# Altium project ESP_Grow_Main_Rev_B.PrjPCB (part 1 of 2)
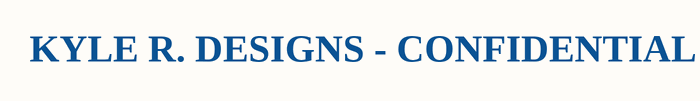
[diagram p0: ESP_Grow_Main_Rev_B_0_Title.SchDoc]
6 sheets, 125 parts. Net scope: global (net labels, ports and power ports of the same name join across sheets).
Board file: ESP_Grow_Main_Rev_B.PcbDoc
Sheets:
  ESP_Grow_Main_Rev_B_0_Title.SchDoc
  ESP_Grow_Main_Rev_B_1_CPU.SchDoc
  ESP_Grow_Main_Rev_B_2_Con.SchDoc
  ESP_Grow_Main_Rev_B_3.SchDoc
  ESP_Grow_Main_Rev_B_4_3V_5V.SchDoc
  ESP_Grow_Main_Rev_B_5_ChangeLog.SchDoc

## Sheet ESP_Grow_Main_Rev_B_0_Title.SchDoc
size A

### Notes on the sheet
- KYLE R. DESIGNS - CONFIDENTIAL

## Sheet ESP_Grow_Main_Rev_B_1_CPU.SchDoc
size A
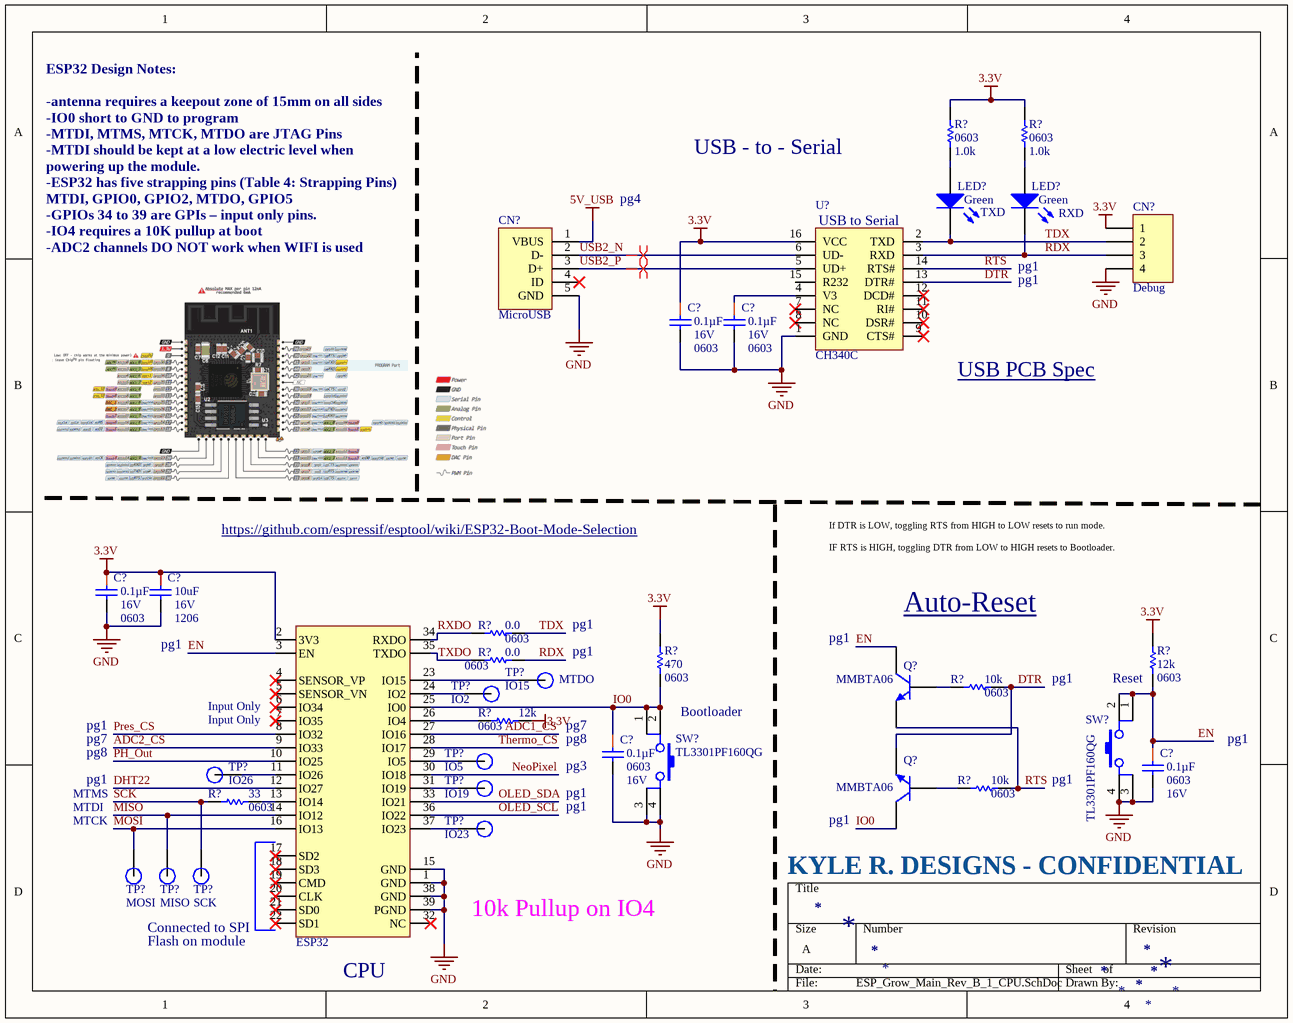
[diagram p1: ESP_Grow_Main_Rev_B_1_CPU.SchDoc]

### Parts
(Parts that share a designator on the sheet are numbered #1, #2 ... from top to bottom, then left to right.)
C?#1  Capacitance: 0.1µF  Package / Case: 0603  Voltage - Rated: 16V  [CAPC0603(1608)_L]  (hidden comment: 0.1uF)
C?#2  Capacitance: 0.1µF  Package / Case: 0603  Voltage - Rated: 16V  [CAPC0603(1608)_L]  (hidden comment: 0.1uF)
C?#3  Capacitance: 0.1µF  Package / Case: 0603  Voltage - Rated: 16V  [CAPC0603(1608)_L]  (hidden comment: 0.1uF)
C?#4  10uF  Voltage - Rated: 16V  Package: 1206  [CAPC1206(3216)_M]
C?#5  Capacitance: 0.1µF  Package / Case: 0603  Voltage - Rated: 16V  [CAPC0603(1608)_L]  (hidden comment: 0.1uF)
C?#6  Capacitance: 0.1µF  Package / Case: 0603  Voltage - Rated: 16V  [CAPC0603(1608)_L]  (hidden comment: 0.1uF)
CN?#1  Debug  [HDR1X4]
CN?#2  MicroUSB  [10118194-0001LF]
LED?#1  TXD  Color: Green  [SM-LED-0603]
LED?#2  RXD  Color: Green  [SM-LED-0603]
Q?#1  MMBTA06  [SOT23]
Q?#2  MMBTA06  [SOT23]
R?#1  Package / Case: 0603  [RESC0603(1608)_N]  (hidden comment: 1.0K)
R?#2  Package / Case: 0603  [RESC0603(1608)_N]  (hidden comment: 1.0K)
R?#3  Resistance (Ohms): 0.0  Package / Case: 0603  [RESC0603(1608)_N]  (hidden comment: 0)
R?#4  Resistance (Ohms): 0.0  Package / Case: 0603  [RESC0603(1608)_N]  (hidden comment: 0)
R?#5  Package / Case: 0603  [RESC0603(1608)_N]  (hidden comment: 470)
R?#6  Package / Case: 0603  [RESC0603(1608)_N]  (hidden comment: 12K)
R?#7  Resistance (Ohms): 10k  Package / Case: 0603  [RESC0603(1608)_L]  (hidden comment: 10K 1%)
R?#8  Package / Case: 0603  [RESC0603(1608)_N]  (hidden comment: 12K)
R?#9  Resistance (Ohms): 10k  Package / Case: 0603  [RESC0603(1608)_L]  (hidden comment: 10K 1%)
R?#10  Package / Case: 0603  [RESC0603(1608)_L]  (hidden comment: 33)
SW?#1  TL3301PF160QG  [TL3301PF160QG]
SW?#2  TL3301PF160QG  [TL3301PF160QG]
TP?#1  IO15  [TestPoint-Silk]  (no BOM)
TP?#2  IO2  [TestPoint-Silk]  (no BOM)
TP?#3  IO5  [TestPoint-Silk]  (no BOM)
TP?#4  IO26  [TestPoint-Silk]  (no BOM)
TP?#5  IO19  [TestPoint-Silk]  (no BOM)
TP?#6  IO23  [TestPoint-Silk]  (no BOM)
TP?#7  MOSI  [TestPoint-Silk]  (no BOM)
TP?#8  MISO  [TestPoint-Silk]  (no BOM)
TP?#9  SCK  [TestPoint-Silk]  (no BOM)
U?#1  CH340C  [SOP-16]
U?#2  ESP32  [ESP32]

### Nets
3.3V: C?#1.1 C?#3.1 C?#4.1 CN?#1.1 R?#1.2 R?#2.2 R?#5.2 R?#6.2 R?#8.1 U?#1.16(VCC) U?#2.2(3V3)
5V_USB: CN?#2.1(VBUS)
GND: C?#1.2 C?#2.2 C?#3.2 C?#4.2 C?#5.2 C?#6.2 CN?#1.4 CN?#2.5(GND) SW?#1.3 SW?#1.4 SW?#2.3 SW?#2.4 U?#1.1(GND) U?#2.1(GND) U?#2.15(GND) U?#2.38(GND) U?#2.39(PGND)
ADC1_CS: U?#2.27(IO16)
ADC2_CS: U?#2.9(IO33)
DHT22: U?#2.12(IO27)
DTR: Q?#2.2(E) R?#7.1 U?#1.13(DTR#)
EN: C?#6.1 Q?#1.3(C) R?#6.1 SW?#1.1 SW?#1.2 U?#2.3(EN)
IO0: C?#5.1 Q?#2.3(C) R?#5.1 SW?#2.1 SW?#2.2 U?#2.25(IO0)
MISO: TP?#8.1 U?#2.14(IO12)
MOSI: TP?#7.1 U?#2.16(IO13)
NeoPixel: U?#2.30(IO18)
OLED_SCL: U?#2.36(IO22)
OLED_SDA: U?#2.33(IO21)
PH_Out: U?#2.10(IO25)
Pres_CS: U?#2.8(IO32)
RDX: CN?#1.3 LED?#2.2 R?#4.1 U?#1.3(RXD)
RTS: Q?#1.2(E) R?#9.1 U?#1.14(RTS#)
RXDO: R?#3.2 U?#2.34(RXDO)
SCK: R?#10.2 TP?#9.1
TDX: CN?#1.2 LED?#1.2 R?#3.1 U?#1.2(TXD)
Thermo_CS: U?#2.28(IO17)
TXDO: R?#4.2 U?#2.35(TXDO)
USB2_N: CN?#2.2(D-) U?#1.6(UD-)
USB2_P: CN?#2.3(D+) U?#1.5(UD+)
NetC?#2_1: C?#2.1 U?#1.4(V3)
NetLED?#1_1: LED?#1.1 R?#1.1
NetLED?#2_1: LED?#2.1 R?#2.1
NetQ?#1_1: Q?#1.1(B) R?#7.2
NetQ?#2_1: Q?#2.1(B) R?#9.2
NetR?#8_2: R?#8.2 U?#2.26(IO4)
NetR?#10_1: R?#10.1 U?#2.13(IO14)
NetTP?#1_1: TP?#1.1 U?#2.23(IO15)
NetTP?#2_1: TP?#2.1 U?#2.24(IO2)
NetTP?#3_1: TP?#3.1 U?#2.29(IO5)
NetTP?#4_1: TP?#4.1 U?#2.11(IO26)
NetTP?#5_1: TP?#5.1 U?#2.31(IO19)
NetTP?#6_1: TP?#6.1 U?#2.37(IO23)

Not connected (* = marked no-connect by the designer): CN?#2 4(ID)*; U?#1 7(NC)* 8(NC)* 9(CTS#)* 10(DSR#)* 11(RI#)* 12(DCD#)* 15(R232); U?#2 4(SENSOR_VP)* 5(SENSOR_VN)* 6(IO34)* 7(IO35)* 17(SD2)* 18(SD3)* 19(CMD)* 20(CLK)* 21(SD0)* 22(SD1)* 32(NC)*

### Layout directives
differential pair: USB2_N, USB2_P

### Notes on the sheet
- USB - to - Serial
- pg4
- pg1
- (near LED?#2) pg1
- USB PCB Spec <https://www.ftdichip.com/Support/Documents/AppNotes/AN_146_USB_Hardware_Design_Guidelines_for_FTDI_ICs.pdf>
- ESP32 Design Notes:
  -antenna requires a keepout zone of 15mm on all sides
  -IO0 short to GND to program
  -MTDI, MTMS, MTCK, MTDO are JTAG Pins
  -MTDI should be kept at a low electric level when powering up the module.
  -ESP32 has five strapping pins (Table 4: Strapping Pins) MTDI, GPIO0, GPIO2, MTDO, GPIO5
  -GPIOs 34 to 39 are GPIs – input only pins.
  -IO4 requires a 10K pullup at boot
  -ADC2 channels DO NOT work when WIFI is used
- https://github.com/espressif/esptool/wiki/ESP32-Boot-Mode-Selection
- If DTR is LOW, toggling RTS from HIGH to LOW resets to run mode.
  IF RTS is HIGH, toggling DTR from LOW to HIGH resets to Bootloader.
- Auto-Reset <https://cdn.sparkfun.com/assets/learn_tutorials/5/0/7/esp32-thing-schematic.pdf>
- (near C?#4) pg1
- (near TP?#1) MTDO
- (near TP?#1) pg1
- (near R?#6) Reset
- pg7
- pg8
- (near U?#2) Input Only
- (near C?#5) pg3
- (near C?#5) pg8
- Bootloader
- MTMS
- MTDI
- MTCK
- (near C?#5) pg1
- (near Q?#2) pg1
- KYLE R. DESIGNS - CONFIDENTIAL
- Flash on module
- Connected to SPI
- 10k Pullup on IO4
- (near U?#2) CPU
- (in symbol CH340C) USB to Serial

### Library data of the parts
C?#1-C?#3 C?#5 C?#6 = CAP CER 0.1UF 16V 10% X7R 0603: 0.1uF 0603 16V; Manufacturer: Kemet; Manufacturer Part Number: C0603C104K4RACTU; Tolerance: ±10%; Temperature Coefficient: X7R; Supplier 1: Digi-Key; RoHS: RoHS Compliant; Category: Capacitors; Stock 1: 2360000; Pricing 1: 4000=0.00414, 8000=0.00378, 12000=0.0036, 28000=0.00342, 100000=0.00248 (USD); Packaging: Tape & Reel (TR); Mounting Type: Surface Mount, MLCC; Operating Temperature: -55°C ~ 125°C; Applications: General Purpose; Ratings: -; Size / Dimension: 0.063" L x 0.031" W (1.60mm x 0.80mm); Height - Seated (Max): -; Thickness (Max): 0.034" (0.87mm); Lead Spacing: -; Features: -; Lead Style: -; ComponentLink1URL: http://www.kemet.com/datasheets&C0603C104K4RACTU; ComponentLink1Description: http://www.kemet.com/datasheets&C0603C104K4RACTU; Supplier Part Number 1: 399-1096-2-ND
C?#4 = CAP CER 10UF 16V 1206: Temperature Coefficient: X7R; LCSC: C126600; Capacitance: 10uF; Supplier 1: Digi-Key; Supplier Part Number 1: 490-4793-1-ND
CN?#1 = Header 4: Header, 4-Pin; Manufacturer: Sullins Connector Solutions; Manufacturer Part Number: PRPC004SAAN-RC; Connector Type: Header, Unshrouded, Breakaway; Number of Positions: 4; Number of Positions Loaded: All; Pitch: 0.100" (2.54mm); Supplier 1: Digi-Key; RoHS: RoHS Compliant; Category: Connectors, Interconnects; Stock 1: 0; Pricing 1: 1=0.2, 10=0.175, 100=0.1443, 500=0.1141, 1000=0.09794, 5000=0.08935, 10000=0.08591 (USD); Packaging: Bulk; Contact Type: Male Pin; Number of Rows: 1; Row Spacing: -; Contact Mating Length: 0.230" (5.84mm); Mounting Type: Through Hole; Termination: Solder; Fastening Type: -; Features: -; Contact Finish: Gold; Contact Finish Thickness: Flash; Color: Black; ComponentLink1URL: http://media.digikey.com/PDF/Data%20Sheets/Sullins%20PDFs/xRxCzzzSxxN-RC_ST_11635-B.pdf; ComponentLink1Description: http://media.digikey.com/PDF/Data%20Sheets/Sullins%20PDFs/xRxCzzzSxxN-RC_ST_11635-B.pdf; Supplier Part Number 1: S1011EC-04-ND
CN?#2 = 10118194-0001LF: Amphenol FCI CONN USB MICRO B RECPT SMT R/A; Connector Type: USB - micro B; Number of Contacts: 5; Gender: Receptacle; Specifications: USB 2.0; Number of Ports: 1; Current Rating: 1.8A per Contact; Voltage - Rated: 100VAC; Mating Cycles: 10000; Shielding: Shielded; Material Flammability Rating: UL94 V-0; ClassName: *; Supplier 1: Digi-Key; Manufacturer: Amphenol FCI; Manufacturer Part Number: 10118194-0001LF; RoHS: RoHS Compliant; Category: Connectors, Interconnects; Stock 1: 220681; Pricing 1: 1=0.46, 10=0.437, 25=0.3744, 50=0.318, 100=0.3056, 250=0.27444, 500=0.26196 (USD); Packaging: Cut Tape (CT); Part Status: Active; Mounting Type: Surface Mount, Right Angle; Through Hole; Mounting Feature: Horizontal; Termination: Solder; Features: Solder Retention; Ingress Protection: -; Operating Temperature: -30°C ~ 80°C; Contact Finish: Gold; Shell/Shielding Material: Steel, Stainless; Insulation Color: Black; ComponentLink1URL: http://portal.fciconnect.com/Comergent//fci/drawing/10118194.pdf; ComponentLink1Description: http://portal.fciconnect.com/Comergent//fci/drawing/10118194.pdf; Supplier Part Number 1: 609-4618-1-ND
LED?#1 LED?#2 = LTST-C191KGKT: LED GREEN CLEAR THIN 0603 SMD; Manufacturer: Lite-On Inc; Wavelength - Dominant: 571nm; Wavelength - Peak: 574nm; Millicandela Rating: 35mcd; Voltage - Forward (Vf) (Typ): 2V; Current - Test: 20mA; Viewing Angle: 130°; Lens Style/Size: Rectangle with Flat Top, 1.1mm x 0.8mm; Supplier 1: Digi-Key; Manufacturer Part Number: LTST-C191KGKT; RoHS: RoHS Compliant; Category: Optoelectronics; Stock 1: 84829; Pricing 1: 1=0.3, 10=0.238, 100=0.1296, 250=0.0864, 500=0.07344, 1000=0.05616, 2500=0.05076 (USD); Packaging: Cut Tape (CT); Lens Type: Clear; Package / Case: 0603 (1608 Metric); Size / Dimension: 1.60mm L x 0.80mm W; Height: 0.55mm; Mounting Type: Surface Mount; Luminous Flux @ Current - Test: -; ComponentLink1URL: http://optoelectronics.liteon.com/upload/download/DS22-2000-228/S_110_LTST-C191KGKT.pdf; ComponentLink1Description: http://optoelectronics.liteon.com/upload/download/DS22-2000-228/S_110_LTST-C191KGKT.pdf; Supplier Part Number 1: 160-1446-1-ND; ClassName: *
Q?#1 Q?#2 = MMBTA06: TRANS NPN 80V 0.5A SOT-23; Manufacturer: ON Semiconductor; Manufacturer Part Number: MMBTA06LT3G; Vce Saturation (Max) @ Ib, Ic: 250mV @ 10mA, 100mA; Current - Collector Cutoff (Max): 100nA; DC Current Gain (hFE) (Min) @ Ic, Vce: 100 @ 100mA, 1V; Frequency - Transition: 100MHz; Supplier 1: Digi-Key; RoHS: RoHS Compliant; Category: Discrete Semiconductor Products; Stock 1: 16604; Pricing 1: 1=0.21, 10=0.196, 100=0.1067, 500=0.06566, 1000=0.04476 (USD); Packaging: Cut Tape (CT); Part Status: Active; Transistor Type: NPN; Operating Temperature: -55°C ~ 150°C (TJ); Mounting Type: Surface Mount; Package / Case: TO-236-3, SC-59, SOT-23-3; Supplier Device Package: SOT-23-3 (TO-236); Base Part Number: MMBTA06; ComponentLink1URL: http://www.onsemi.com/pub/Collateral/MMBTA05LT1-D.PDF; ComponentLink1Description: http://www.onsemi.com/pub/Collateral/MMBTA05LT1-D.PDF; Supplier Part Number 1: MMBTA06LT3GOSCT-ND
R?#1 R?#2 = RES 1K OHM 1% 1/10W 0603: 1.0K 0603; Manufacturer: Stackpole Electronics Inc.; Manufacturer Part Number: RMCF0603FT1K00; Tolerance: ±1%; Power (Watts): 0.1W, 1/10W; Temperature Coefficient: ±100ppm/°C; Supplier 1: Digi-Key; RoHS: RoHS Compliant; Category: Resistors; Stock 1: 411308; Pricing 1: 1=0.1, 10=0.02, 100=0.0081, 1000=0.00364, 2500=0.00316 (USD); Packaging: Cut Tape (CT); Part Status: Active; Composition: Thick Film; Features: Automotive AEC-Q200; Operating Temperature: -55°C ~ 155°C; Size / Dimension: 0.061" L x 0.031" W (1.55mm x 0.80mm); Height - Seated (Max): 0.022" (0.55mm); Failure Rate: -; ComponentLink1URL: https://www.seielect.com/Catalog/SEI-RMCF_RMCP.pdf; ComponentLink1Description: https://www.seielect.com/Catalog/SEI-RMCF_RMCP.pdf; Supplier Part Number 1: RMCF0603FT1K00CT-ND; Supplier Device Package: 0603; Resistance (Ohms): 1.0k
R?#3 R?#4 = RES 0.0 OHM 1/10W JUMP 0603 SMD: 0 0603; Manufacturer: Panasonic Electronic Components; Manufacturer Part Number: ERJ-3GEY0R00V; Tolerance: Jumper; Power (Watts): 0.1W, 1/10W; Supplier 1: Digi-Key; RoHS: RoHS Compliant; Category: Resistors; Stock 1: 4812214; Pricing 1: 1=0.1, 50=0.0126, 100=0.0096, 250=0.00716, 500=0.00528, 1000=0.00352, 2500=0.00297 (USD); Packaging: Cut Tape (CT); Composition: Thick Film; Features: -; Temperature Coefficient: -; Supplier Device Package: 0603; Size / Dimension: 0.063" L x 0.031" W (1.60mm x 0.80mm); Height: 0.022" (0.55mm); Number of Terminations: 2; ComponentLink1URL: http://industrial.panasonic.com/www-cgi/jvcr13pz.cgi?E+PZ+3+AOA0001+ERJ3GEY0R00V+7+WW; ComponentLink1Description: http://industrial.panasonic.com/www-cgi/jvcr13pz.cgi?E+PZ+3+AOA0001+ERJ3GEY0R00V+7+WW; Supplier Part Number 1: P0.0GCT-ND
R?#5 = RES 470 OHM 1/10W 1% 0603 SMD: 470 0603; Manufacturer: Yageo; Manufacturer Part Number: RC0603FR-07470RL; Tolerance: ±1%; Power (Watts): 0.1W, 1/10W; Temperature Coefficient: ±100ppm/°C; Supplier 1: Digi-Key; RoHS: RoHS Compliant; Category: Resistors; Stock 1: 184849; Pricing 1: 1=0.1, 10=0.015, 25=0.0108, 100=0.006, 250=0.00456, 500=0.00364, 1000=0.00268, 2500=0.00233 (USD); Packaging: Cut Tape (CT); Resistance (Ohms): 470; Composition: Thick Film; Features: -; Supplier Device Package: 0603; Size / Dimension: 0.063" L x 0.031" W (1.60mm x 0.80mm); Height: 0.022" (0.55mm); Number of Terminations: 2; ComponentLink1URL: http://www.yageo.com/documents/recent/PYu-RC0603_51_RoHS_L_4.pdf; ComponentLink1Description: http://www.yageo.com/documents/recent/PYu-RC0603_51_RoHS_L_4.pdf; Supplier Part Number 1: 311-470HRCT-ND
R?#6 R?#8 = RES 12K OHM 1/10W 1% 0603 SMD: 12K 1% 0603; Manufacturer: Rohm Semiconductor; Manufacturer Part Number: MCR03ERTF1202; Power (Watts): 0.1W, 1/10W; Temperature Coefficient: ±100ppm/°C; Supplier 1: Digi-Key; RoHS: RoHS Compliant; Category: Resistors; Stock 1: 128338; Pricing 1: 1=0.1, 10=0.011, 25=0.0084, 100=0.0047, 250=0.00356, 500=0.00286, 1000=0.0021 (USD); Packaging: Cut Tape (CT); Tolerance: ±1%; Composition: Thick Film; Features: -; Operating Temperature: -55°C ~ 155°C; Supplier Device Package: 0603 (1608 Metric); Size / Dimension: 0.063" L x 0.031" W (1.60mm x 0.80mm); Height: 0.022" (0.55mm); Number of Terminations: 2; ComponentLink1URL: http://rohmfs.rohm.com/en/products/databook/datasheet/passive/resistor/chip_resistor/mcr_g.pdf; ComponentLink1Description: http://rohmfs.rohm.com/en/products/databook/datasheet/passive/resistor/chip_resistor/mcr_g.pdf; Supplier Part Number 1: RHM12.0KCLCT-ND; Resistance (Ohms): 12k
R?#7 R?#9 = RES 10K OHM 1/10W 1% 0603 SMD: 10K 0603; Manufacturer: Panasonic Electronic Components; Manufacturer Part Number: ERJ-3EKF1002V; Power (Watts): 0.1W, 1/10W; Temperature Coefficient: ±100ppm/°C; Category: Resistors; Supplier 1: Digi-Key; RoHS: RoHS Compliant; Stock 1: 5046430; Pricing 1: 1=0.1, 50=0.015, 100=0.0114, 250=0.00844, 500=0.00624, 1000=0.00416, 2500=0.00351 (USD); Packaging: Cut Tape (CT); Tolerance: ±1%; Composition: Thick Film; Features: -; Supplier Device Package: 0603; Size / Dimension: 0.063" L x 0.031" W (1.60mm x 0.80mm); Height: 0.022" (0.55mm); Number of Terminations: 2; ComponentLink1URL: http://industrial.panasonic.com/www-cgi/jvcr13pz.cgi?E+PZ+3+AOA0002+ERJ3EKF1002V+7+WW; ComponentLink1Description: http://industrial.panasonic.com/www-cgi/jvcr13pz.cgi?E+PZ+3+AOA0002+ERJ3EKF1002V+7+WW; Supplier Part Number 1: P10.0KHCT-ND
R?#10 = RES 33 OHM 1/10W 5% 0603 SMD: 33 0603; Manufacturer: Panasonic Electronic Components; Manufacturer Part Number: ERJ-3GEYJ330V; Tolerance: ±5%; Power (Watts): 0.1W, 1/10W; Temperature Coefficient: ±200ppm/°C; Supplier 1: Digi-Key; RoHS: RoHS Compliant; Category: Resistors; Stock 1: 499360; Pricing 1: 1=0.1, 50=0.0126, 100=0.0096, 250=0.00716, 500=0.00528, 1000=0.00352, 2500=0.00297 (USD); Packaging: Cut Tape (CT); Resistance (Ohms): 33; Composition: Thick Film; Features: -; Supplier Device Package: 0603; Size / Dimension: 0.063" L x 0.031" W (1.60mm x 0.80mm); Height: 0.022" (0.55mm); Number of Terminations: 2; ComponentLink1URL: http://industrial.panasonic.com/www-cgi/jvcr13pz.cgi?E+PZ+3+AOA0001+ERJ3GEYJ330V+7+WW; ComponentLink1Description: http://industrial.panasonic.com/www-cgi/jvcr13pz.cgi?E+PZ+3+AOA0001+ERJ3GEYJ330V+7+WW; Supplier Part Number 1: P33GCT-ND
SW?#1 SW?#2 = TL3301PF160QG: SWITCH TACTILE SPST-NO 0.05A 12V; Manufacturer: E-Switch; Switch Function: Off-Mom; Contact Rating @ Voltage: 0.05A @ 12VDC; Actuator Type: Standard; Actuator Height off PCB, Vertical: 8.50mm; Actuator Orientation: Top Actuated; Outline: 6.00mm x 6.00mm; Illumination: Non-Illuminated; Operating Force: 160gf; Actuator Material: Polyamide (PA), Nylon; Switch Travel: 0.25mm; Mechanical Life: 100,000 Cycles; ClassName: *; Supplier 1: Digi-Key; Manufacturer Part Number: TL3301PF160QG; RoHS: RoHS Compliant; Category: Switches; Stock 1: 25527; Pricing 1: 1=0.38, 10=0.37, 25=0.3564, 50=0.3432, 100=0.33, 250=0.3036 (USD); Packaging: Cut Tape (CT); Part Status: Active; Circuit: SPST-NO; Mounting Type: Surface Mount; Actuator Length, Right Angle: -; Termination Style: Gull Wing; Illumination Type, Color: -; Illumination Voltage (Nominal): -; Ingress Protection: -; Features: -; Operating Temperature: -20°C ~ 70°C; ComponentLink1URL: https://www.e-switch.com/system/asset/product_line/data_sheet/158/TL3301.pdf; ComponentLink1Description: https://www.e-switch.com/system/asset/product_line/data_sheet/158/TL3301.pdf; Supplier Part Number 1: EG4562CT-ND
TP?#1-TP?#9 = TestPoint - Current: Test Point
U?#1 = CH340C: USB to Serial UART; ComponentLink2URL: https://lcsc.com/product-detail/USB_CH340C_C84681.html; ComponentLink1URL: https://www.sparkfun.com/products/15096; ComponentLink2Description: LCSC Part Link; ComponentLink1Description: Sparkfun Demo Board
U?#2 = U/ESP32-WROOM-32D: ESP32 module

## Sheet ESP_Grow_Main_Rev_B_2_Con.SchDoc: Connectors
size A; Date: 06/02/2019; Author: Kyle R.; Revision: B; SheetNumber: 1; SheetTotal: 3
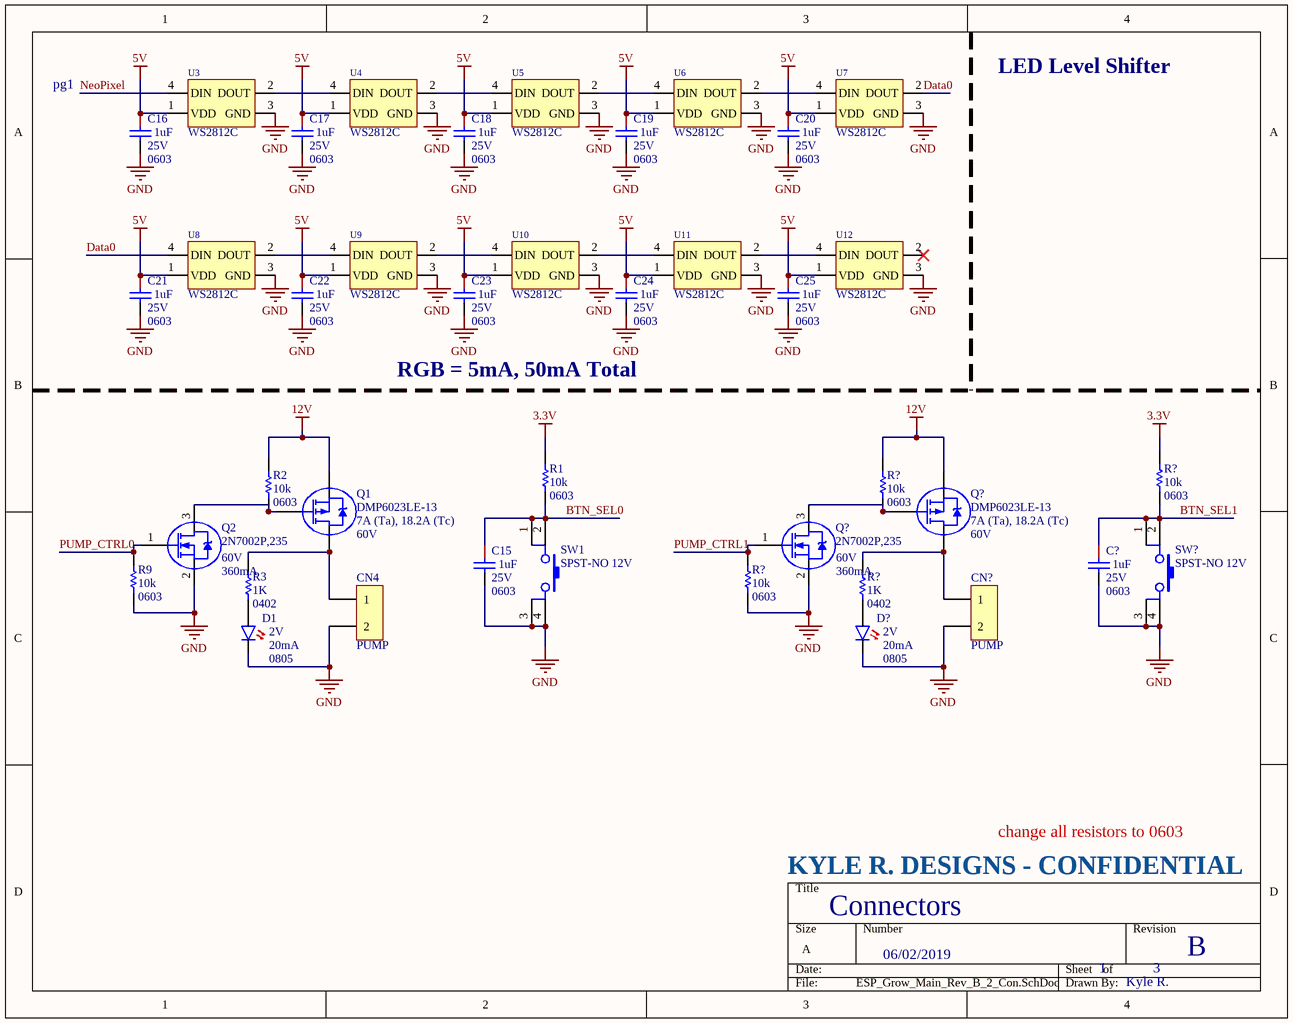
[diagram p2: ESP_Grow_Main_Rev_B_2_Con.SchDoc]

### Parts
(Parts that share a designator on the sheet are numbered #1, #2 ... from top to bottom, then left to right.)
C15  1uF  Voltage - Rated: 25V  Package / Case: 0603  [CAPC0603(1608)_N]
C16  1uF  Voltage - Rated: 25V  Package / Case: 0603  [CAPC0603(1608)_N]
C17  1uF  Voltage - Rated: 25V  Package / Case: 0603  [CAPC0603(1608)_N]
C18  1uF  Voltage - Rated: 25V  Package / Case: 0603  [CAPC0603(1608)_N]
C19  1uF  Voltage - Rated: 25V  Package / Case: 0603  [CAPC0603(1608)_N]
C20  1uF  Voltage - Rated: 25V  Package / Case: 0603  [CAPC0603(1608)_N]
C21  1uF  Voltage - Rated: 25V  Package / Case: 0603  [CAPC0603(1608)_N]
C22  1uF  Voltage - Rated: 25V  Package / Case: 0603  [CAPC0603(1608)_N]
C23  1uF  Voltage - Rated: 25V  Package / Case: 0603  [CAPC0603(1608)_N]
C24  1uF  Voltage - Rated: 25V  Package / Case: 0603  [CAPC0603(1608)_N]
C25  1uF  Voltage - Rated: 25V  Package / Case: 0603  [CAPC0603(1608)_N]
C?#7  1uF  Voltage - Rated: 25V  Package / Case: 0603  [CAPC0603(1608)_N]
CN4  PUMP  [Molex 1x2 Microfit 3.0]
CN?#3  PUMP  [Molex 1x2 Microfit 3.0]
D1  Voltage - Forward (Vf) (Typ): 2V  Current - Test: 20mA  Package / Case: 0805  [D/0805]  (hidden comment: D/LEDR/0805)
D?  Voltage - Forward (Vf) (Typ): 2V  Current - Test: 20mA  Package / Case: 0805  [D/0805]  (hidden comment: D/LEDR/0805)
Q1  DMP6023LE-13  Current - Continuous Drain (Id) @ 25°C: 7A (Ta), 18.2A (Tc)  Drain to Source Voltage (Vdss): 60V  [SOT-223 - DMP6023LE]
Q2  2N7002P,235  Continuous Drain Current (ID): 360mA  Drain to Source Breakdown Voltage: 60V  [SOT23-3L]
Q?#3  DMP6023LE-13  Current - Continuous Drain (Id) @ 25°C: 7A (Ta), 18.2A (Tc)  Drain to Source Voltage (Vdss): 60V  [SOT-223 - DMP6023LE]
Q?#4  2N7002P,235  Continuous Drain Current (ID): 360mA  Drain to Source Breakdown Voltage: 60V  [SOT23-3L]
R1  Resistance (Ohms): 10k  Package / Case: 0603  [RESC0603(1608)_N]  (hidden comment: 10K 1%)
R2  Resistance (Ohms): 10k  Package / Case: 0603  [RESC0603(1608)_N]  (hidden comment: 10K 1%)
R3  Package / Case: 0402  [RESC0402(1005)_L]  (hidden comment: 1K)
R9  Resistance (Ohms): 10k  Package / Case: 0603  [RESC0603(1608)_N]  (hidden comment: 10K 1%)
R?#11  Resistance (Ohms): 10k  Package / Case: 0603  [RESC0603(1608)_N]  (hidden comment: 10K 1%)
R?#12  Resistance (Ohms): 10k  Package / Case: 0603  [RESC0603(1608)_N]  (hidden comment: 10K 1%)
R?#13  Resistance (Ohms): 10k  Package / Case: 0603  [RESC0603(1608)_N]  (hidden comment: 10K 1%)
R?#14  Package / Case: 0402  [RESC0402(1005)_L]  (hidden comment: 1K)
SW1  SPST-NO 12V  [SW TACT Red 6mm x 6mm]
SW?#3  SPST-NO 12V  [SW TACT Red 6mm x 6mm]
U3  WS2812C  [WS2812C]
U4  WS2812C  [WS2812C]
U5  WS2812C  [WS2812C]
U6  WS2812C  [WS2812C]
U7  WS2812C  [WS2812C]
U8  WS2812C  [WS2812C]
U9  WS2812C  [WS2812C]
U10  WS2812C  [WS2812C]
U11  WS2812C  [WS2812C]
U12  WS2812C  [WS2812C]

### Nets
3.3V: R1.2 R?#11.2
5V: C16.1 C17.1 C18.1 C19.1 C20.1 C21.1 C22.1 C23.1 C24.1 C25.1 U3.1(VDD) U4.1(VDD) U5.1(VDD) U6.1(VDD) U7.1(VDD) U8.1(VDD) U9.1(VDD) U10.1(VDD) U11.1(VDD) U12.1(VDD)
12V: Q1.S Q?#3.S R2.2 R?#12.2
GND: C15.2 C16.2 C17.2 C18.2 C19.2 C20.2 C21.2 C22.2 C23.2 C24.2 C25.2 C?#7.2 CN4.2 CN?#3.2 D1.1 D?.1 Q2.2(S) Q?#4.2(S) R9.1 R?#13.1 SW1.3 SW1.4 SW?#3.3 SW?#3.4 U3.3(GND) U4.3(GND) U5.3(GND) U6.3(GND) U7.3(GND) U8.3(GND) U9.3(GND) U10.3(GND) U11.3(GND) U12.3(GND)
BTN_SEL0: C15.1 R1.1 SW1.1 SW1.2
BTN_SEL1: C?#7.1 R?#11.1 SW?#3.1 SW?#3.2
Data0: U7.2(DOUT) U8.4(DIN)
NeoPixel: U3.4(DIN)
PUMP_CTRL0: Q2.1(G) R9.2
PUMP_CTRL1: Q?#4.1(G) R?#13.2
NetCN4_1: CN4.1 Q1.D R3.2
NetCN?#3_1: CN?#3.1 Q?#3.D R?#14.2
NetD1_2: D1.2 R3.1
NetD?_2: D?.2 R?#14.1
NetQ1_G: Q1.G Q2.3(D) R2.1
NetQ?#3_G: Q?#3.G Q?#4.3(D) R?#12.1
NetU3_2: U3.2(DOUT) U4.4(DIN)
NetU4_2: U4.2(DOUT) U5.4(DIN)
NetU5_2: U5.2(DOUT) U6.4(DIN)
NetU6_2: U6.2(DOUT) U7.4(DIN)
NetU8_2: U8.2(DOUT) U9.4(DIN)
NetU9_2: U9.2(DOUT) U10.4(DIN)
NetU10_2: U10.2(DOUT) U11.4(DIN)
NetU11_2: U11.2(DOUT) U12.4(DIN)

Not connected (* = marked no-connect by the designer): U12 2(DOUT)*

### Notes on the sheet
- pg1
- LED Level Shifter
- RGB = 5mA, 50mA Total
- change all resistors to 0603
- KYLE R. DESIGNS - CONFIDENTIAL

### Library data of the parts
C15-C25 C?#7 = CAP CER 1UF 25V 10% X7R 0603: 1uF 0603 25V; Manufacturer: TDK Corporation; Manufacturer Part Number: CGA3E1X7R1E105K080AC; Tolerance: ±10%; Temperature Coefficient: X7R; Supplier 1: Digi-Key; RoHS: RoHS Compliant; Category: Capacitors; Stock 1: 360610; Pricing 1: 1=0.2, 10=0.135, 100=0.0686, 500=0.04696, 1000=0.04154 (USD); Packaging: Cut Tape (CT); Part Status: Active; Operating Temperature: -55°C ~ 125°C; Features: -; Ratings: AEC-Q200; Applications: Automotive; Failure Rate: -; Mounting Type: Surface Mount, MLCC; Size / Dimension: 0.063" L x 0.032" W (1.60mm x 0.80mm); Height - Seated (Max): -; Thickness (Max): 0.035" (0.90mm); Lead Spacing: -; Lead Style: -; ComponentLink1URL: https://product.tdk.com/info/en/catalog/datasheets/mlcc_automotive_general_en.pdf; ComponentLink1Description: https://product.tdk.com/info/en/catalog/datasheets/mlcc_automotive_general_en.pdf; Supplier Part Number 1: 445-6931-1-ND
CN4 CN?#3 = MICROFIT 3.0 HDR VERT CPI 2CKT: Molex Microfit 1x2 Vert Header; Manufacturer: Molex, LLC; Manufacturer Part Number: 0430450227; Shrouding: Shrouded - 4 Wall; Number of Positions: 2; Number of Positions Loaded: All; Row Spacing: 0.118" (3.00mm); Supplier 1: Digi-Key; RoHS: RoHS Compliant; Category: Connectors, Interconnects; Stock 1: 4002; Pricing 1: 1=0.8, 10=0.705, 50=0.636, 100=0.6083, 250=0.553, 500=0.4977, 1000=0.4424, 2500=0.40092, 5000=0.3871 (USD); Packaging: Tray; Part Status: Active; Connector Type: Header; Contact Type: Male Pin; Pitch: -; Number of Rows: 2; Mounting Type: Through Hole; Termination: Solder; Fastening Type: Locking Ramp; Contact Mating Length: -; Features: Board Guide; Contact Finish: Tin; Contact Finish Thickness: 60µin (1.52µm); Color: Black; ComponentLink1URL: http://www.molex.com/pdm_docs/sd/430450227_sd.pdf; ComponentLink1Description: http://www.molex.com/pdm_docs/sd/430450227_sd.pdf; Supplier Part Number 1: WM10657-ND
D1 D? = D/LEDR/0805: Red 625nm LED Indication - Discrete 2V 0805; Digikey Part: 732-4984-1-ND; Cost: 0.23; Supplier 1: Digi-Key; Supplier Part Number 1: 732-4984-6-ND
Q1 Q?#3 = DMP6023LE-13: MOSFET P-CH 60V 7A SOT223; Manufacturer: Diodes Incorporated; FET Type: P-Channel; Drive Voltage (Max Rds On,  Min Rds On): 4.5V, 10V; Vgs(th) (Max) @ Id: 3V @ 250µA; Vgs (Max): ±20V; Power Dissipation (Max): 2W (Ta); Rds On (Max) @ Id, Vgs: 28 mOhm @ 5A, 10V; Supplier 1: Digi-Key; Manufacturer Part Number: DMP6023LE-13; RoHS: RoHS Compliant; Category: Discrete Semiconductor Products; Stock 1: 16540; Pricing 1: 1=0.95, 10=0.829, 100=0.6396, 500=0.4738, 1000=0.37904 (USD); Packaging: Cut Tape (CT); Part Status: Active; Technology: MOSFET (Metal Oxide); FET Feature: -; Operating Temperature: -55°C ~ 150°C (TJ); Mounting Type: Surface Mount; Supplier Device Package: SOT-223; Package / Case: TO-261-4, TO-261AA; ComponentLink1URL: https://www.diodes.com/assets/Datasheets/DMP6023LE.pdf; ComponentLink1Description: https://www.diodes.com/assets/Datasheets/DMP6023LE.pdf; Supplier Part Number 1: DMP6023LE-13DICT-ND
Q2 Q?#4 = 2N7002P,235: MOSFET N-CH 60V 0.36A SOT-23; Manufacturer: NXP Semiconductors; Rds On Max: 1.6R; Input Capacitance: 50pF; Rise Time: 4ns; Power Dissipation: 420mW; Max Power Dissipation: 350mW; Number of Elements: 1; Turn-On Delay Time: 3ns; Turn-Off Delay Time: 10ns; Fall Time: 5ns; Gate to Source Voltage (Vgs): 20V; FET Type: N-Channel; Current - Continuous Drain (Id) @ 25°C: 360mA (Ta); Drive Voltage (Max Rds On,  Min Rds On): 10V; Vgs(th) (Max) @ Id: 2.4V @ 250µA; Vgs (Max): ±20V; Power Dissipation (Max): 350mW (Ta); Rds On (Max) @ Id, Vgs: 1.6 Ohm @ 500mA, 10V; ComponentLink1URL: http://assets.nexperia.com/documents/data-sheet/2N7002P.pdf; ComponentLink1Description: http://assets.nexperia.com/documents/data-sheet/2N7002P.pdf; ComponentLink2URL: https://datasheet.ciiva.com/4439/2n7002p-99415-4439248.pdf; ComponentLink2Description: https://datasheet.ciiva.com/4439/2n7002p-99415-4439248.pdf; ComponentLink3URL: https://datasheet.ciiva.com/6371/2n7002p-6371141.pdf; ComponentLink3Description: https://datasheet.ciiva.com/6371/2n7002p-6371141.pdf; ComponentLink4URL: https://datasheet.ciiva.com/49067/getdatasheetpartid-765733-49067862.pdf; ComponentLink4Description: https://datasheet.ciiva.com/49067/getdatasheetpartid-765733-49067862.pdf; ComponentLink5URL: https://datasheet.ciiva.com/11168/2n7002p-11168552.pdf; ComponentLink5Description: https://datasheet.ciiva.com/11168/2n7002p-11168552.pdf; ComponentLink6URL: https://datasheet.ciiva.com/26921/getdatasheetpartid-765733-26921227.pdf; ComponentLink6Description: https://datasheet.ciiva.com/26921/getdatasheetpartid-765733-26921227.pdf; ComponentLink7URL: https://datasheet.ciiva.com/15216/getdatasheetpartid-496132-15216636.pdf; ComponentLink7Description: https://datasheet.ciiva.com/15216/getdatasheetpartid-496132-15216636.pdf; ComponentLink8URL: https://datasheet.ciiva.com/46633/discretesemiconductors-46633181.pdf; ComponentLink8Description: https://datasheet.ciiva.com/46633/discretesemiconductors-46633181.pdf; Supplier 1: Digi-Key; Supplier Part Number 1: 568-11588-1-ND; Manufacturer Part Number: 2N7002P,235; Stock 1: 109268; Pricing 1: 1=0.14, 10=0.128, 100=0.07, 500=0.043, 1000=0.0294 (USD); Case/Package: SOT; Number of Pins: 3; Contact Plating: Tin; Min Operating Temperature: -55°C; Max Operating Temperature: 150°C; Package Quantity: 10000; Packaging: Tape and Reel; Max Dual Supply Voltage: 60V; Drain to Source Voltage (Vdss): 60V; Drain to Source Resistance: 1.6R; Radiation Hardening: No; Lead Free: Lead Free; Supplier 2: Digi-Key; RoHS: RoHS Compliant; Category: Discrete Semiconductor Products; Stock 2: 177811; Pricing 2: 1=0.16, 10=0.148, 100=0.0969, 500=0.04738, 1000=0.03231 (USD); Part Status: Active; Technology: MOSFET (Metal Oxide); FET Feature: -; Operating Temperature: -55°C ~ 150°C (TJ); Mounting Type: Surface Mount; Supplier Device Package: TO-236AB (SOT23); Package / Case: TO-236-3, SC-59, SOT-23-3; ComponentLink9URL: https://assets.nexperia.com/documents/data-sheet/2N7002P.pdf; ComponentLink9Description: https://assets.nexperia.com/documents/data-sheet/2N7002P.pdf; Supplier Part Number 2: 1727-1865-1-ND
R1 R2 R9 R?#11-R?#13 = RES 10K OHM 1/10W 1% 0603 SMD: as R?#7 on sheet ESP_Grow_Main_Rev_B_1_CPU; Category: Resistors; Supplier 1: Digi-Key; RoHS: RoHS Compliant; Stock 1: 5046430; Pricing 1: 1=0.1, 50=0.015, 100=0.0114, 250=0.00844, 500=0.00624, 1000=0.00416, 2500=0.00351 (USD); Packaging: Cut Tape (CT); Tolerance: ±1%; Composition: Thick Film; Features: -; Supplier Device Package: 0603; Size / Dimension: 0.063" L x 0.031" W (1.60mm x 0.80mm); Height: 0.022" (0.55mm); Number of Terminations: 2; ComponentLink1URL: http://industrial.panasonic.com/www-cgi/jvcr13pz.cgi?E+PZ+3+AOA0002+ERJ3EKF1002V+7+WW; ComponentLink1Description: http://industrial.panasonic.com/www-cgi/jvcr13pz.cgi?E+PZ+3+AOA0002+ERJ3EKF1002V+7+WW; Supplier Part Number 1: P10.0KHCT-ND
R3 R?#14 = RES 1K OHM 1% 1/16W 0402: 1K 0402; Manufacturer: Yageo; Manufacturer Part Number: RC0402FR-071KL; Tolerance: 1%; Temperature Coefficient: 100ppm/°C; Power Rating: 62.5mW; Voltage Rating: 50V; ComponentLink1URL: https://datasheet.ciiva.com/2453/pyu-r-int-thick-7-2453361.pdf; ComponentLink1Description: https://datasheet.ciiva.com/2453/pyu-r-int-thick-7-2453361.pdf; ComponentLink2URL: https://datasheet.ciiva.com/2453/pyu-r-int-thick-7-2453362.pdf; ComponentLink2Description: https://datasheet.ciiva.com/2453/pyu-r-int-thick-7-2453362.pdf; ComponentLink3URL: https://datasheet.ciiva.com/2453/pyu-r-int-thick-7-2453363.pdf; ComponentLink3Description: https://datasheet.ciiva.com/2453/pyu-r-int-thick-7-2453363.pdf; ComponentLink4URL: https://datasheet.ciiva.com/22747/1018594-22747509.pdf; ComponentLink4Description: https://datasheet.ciiva.com/22747/1018594-22747509.pdf; ComponentLink5URL: https://datasheet.ciiva.com/15189/getdatasheetpartid-323696-15189334.pdf; ComponentLink5Description: https://datasheet.ciiva.com/15189/getdatasheetpartid-323696-15189334.pdf; ComponentLink6URL: https://datasheet.ciiva.com/16740/pyu-rc0402-51-rohs-l-6-r-16740567.pdf; ComponentLink6Description: https://datasheet.ciiva.com/16740/pyu-rc0402-51-rohs-l-6-r-16740567.pdf; ComponentLink7URL: https://datasheet.ciiva.com/12667/pyu-rc0402-51-rohs-l-6-r-12667930.pdf; ComponentLink7Description: https://datasheet.ciiva.com/12667/pyu-rc0402-51-rohs-l-6-r-12667930.pdf; ComponentLink8URL: https://datasheet.ciiva.com/11819/0900766b80c66297-11819452.pdf; ComponentLink8Description: https://datasheet.ciiva.com/11819/0900766b80c66297-11819452.pdf; Supplier 1: Digi-Key; Supplier Part Number 1: 311-1.00KLRCT-ND; Stock 1: 21888659; Pricing 1: 1=0.1, 10=0.014, 100=0.0056, 1000=0.0025, 2500=0.0022, 5000=0.0018 (USD); Case/Package: 0402; Number of Pins: 2; Case Code (Imperial): 0402; Case Code (Metric): 1005; Min Operating Temperature: -55°C; Max Operating Temperature: 155°C; Packaging: Tape and Reel; Composition: Thick Film; Voltage Rating (DC): 50V; Termination: SMD/SMT; Military Standard: Not; Length: 1mm; Height: 0.32mm; Width: 0.5mm; Depth: 0.5mm; REACH SVHC: Unknown; Lead Free: Lead Free; ComponentLink9URL: https://datasheet.ciiva.com/11819/0900766b80c66297-11819477.pdf; ComponentLink9Description: https://datasheet.ciiva.com/11819/0900766b80c66297-11819477.pdf; ComponentLink10URL: https://datasheet.ciiva.com/12666/pyu-rc0402-51-rohs-l-6-r-12666741.pdf; ComponentLink10Description: https://datasheet.ciiva.com/12666/pyu-rc0402-51-rohs-l-6-r-12666741.pdf; ComponentLink11URL: https://datasheet.ciiva.com/17063/pyu-rc0402-51-rohs-l-6-r-17063193.pdf; ComponentLink11Description: https://datasheet.ciiva.com/17063/pyu-rc0402-51-rohs-l-6-r-17063193.pdf; ComponentLink12URL: https://datasheet.ciiva.com/22747/1018594-22747513.pdf; ComponentLink12Description: https://datasheet.ciiva.com/22747/1018594-22747513.pdf; ComponentLink13URL: https://datasheet.ciiva.com/7849/1018594-7849869.pdf; ComponentLink13Description: https://datasheet.ciiva.com/7849/1018594-7849869.pdf; ComponentLink14URL: https://datasheet.ciiva.com/7983/1018594-7983502.pdf; ComponentLink14Description: https://datasheet.ciiva.com/7983/1018594-7983502.pdf; ComponentLink15URL: https://datasheet.ciiva.com/7849/1018594-7849871.pdf; ComponentLink15Description: https://datasheet.ciiva.com/7849/1018594-7849871.pdf; Category: Resistors; Resistance: 1K
SW1 SW?#3 = PTS645SM43SMTR92 LFS: SWITCH TACTILE SPST-NO 0.05A 12V; Manufacturer: C&K; Switch Function: Off-Mom; Contact Rating @ Voltage: 0.05A @ 12VDC; Actuator Type: Standard; Actuator Height off PCB, Vertical: 4.30mm; Actuator Orientation: Top Actuated; Outline: 6.00mm x 6.00mm; Illumination: Non-Illuminated; Operating Force: 160gf; Actuator Material: Polyamide (PA66), Nylon 6/6; Mechanical Life: 100,000 Cycles; ClassName: *; Supplier 1: Digi-Key; Manufacturer Part Number: PTS645SM43SMTR92 LFS; RoHS: RoHS Compliant; Category: Switches; Stock 1: 234699; Pricing 1: 1=0.15, 10=0.147, 25=0.1416, 50=0.1366, 100=0.129, 250=0.12144, 500=0.11638 (USD); Packaging: Cut Tape (CT); Part Status: Active; Circuit: SPST-NO; Mounting Type: Surface Mount; Actuator Length, Right Angle: -; Termination Style: Gull Wing; Illumination Type, Color: -; Illumination Voltage (Nominal): -; Ingress Protection: -; Features: Blue Actuator; Switch Travel: -; Operating Temperature: -20°C ~ 60°C; ComponentLink1URL: http://www.ckswitches.com/media/1471/pts645.pdf; ComponentLink1Description: http://www.ckswitches.com/media/1471/pts645.pdf; Supplier Part Number 1: CKN9112CT-ND
U3-U12 = WS2812C: Serial RGB LED; RGB Current: 5mA; Voltage: 3.5V ~ 5.3V; RED Brightness: 60mcd; GREEN Brightness: 245mcd; BLUE Brightness: 65 mcd; White Brightness: 365 mcd; LCSC: C114587; Datasheet: https://datasheet.lcsc.com/szlcsc/Worldsemi-WS2812C_C114587.pdfhttps://datasheet.lcsc.com/szlcsc/Worldsemi-WS2812C_C114587.pdf

## Sheet ESP_Grow_Main_Rev_B_3.SchDoc
size A
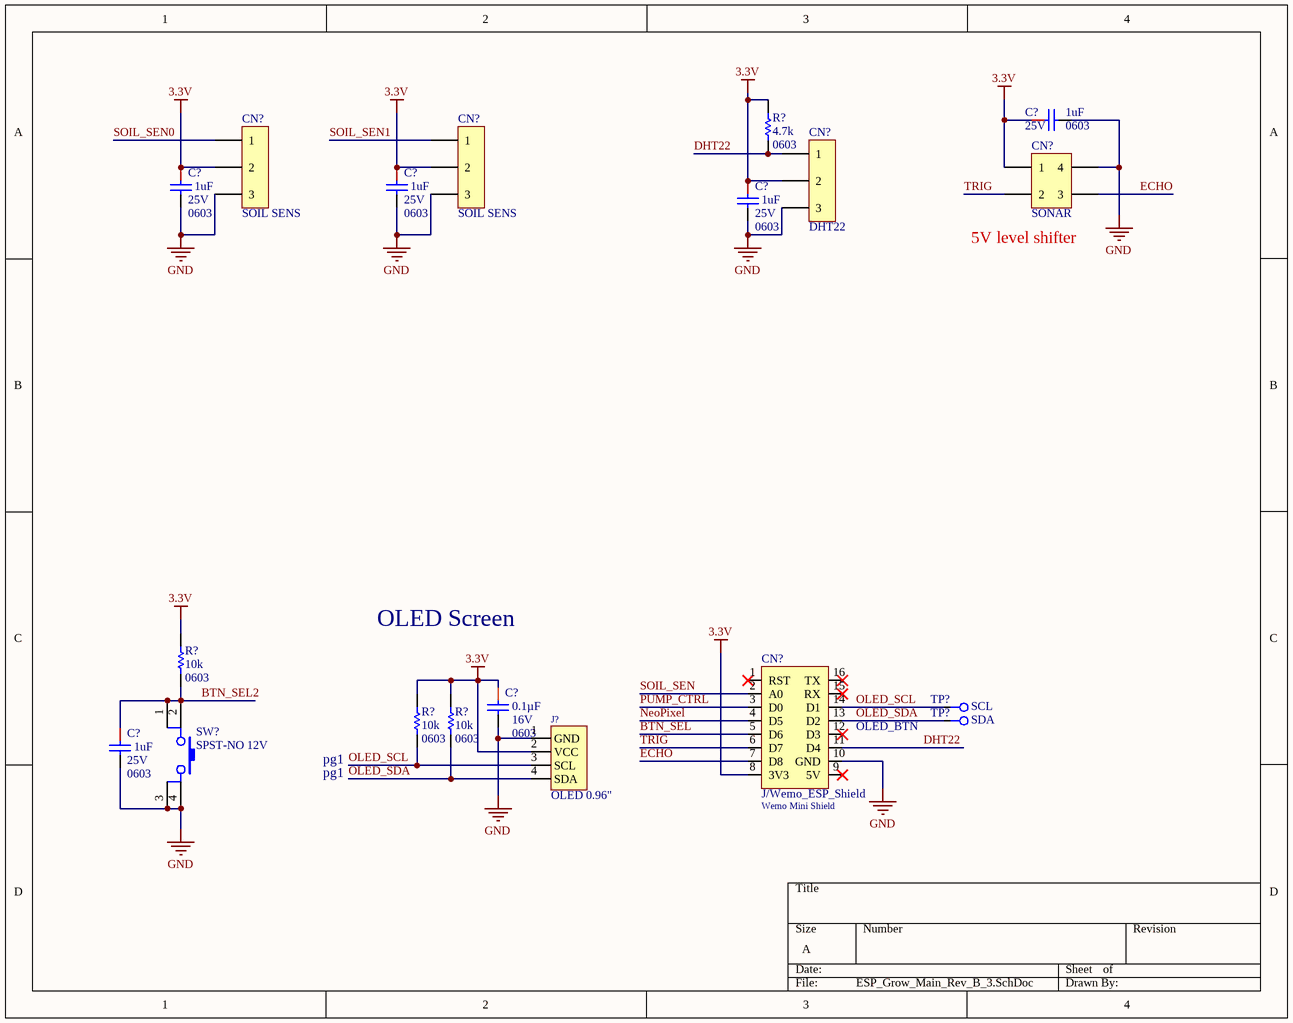
[diagram p3: ESP_Grow_Main_Rev_B_3.SchDoc]

### Parts
(Parts that share a designator on the sheet are numbered #1, #2 ... from top to bottom, then left to right.)
C?#8  1uF  Voltage - Rated: 25V  Package / Case: 0603  [CAPC0603(1608)_N]
C?#9  1uF  Voltage - Rated: 25V  Package / Case: 0603  [CAPC0603(1608)_N]
C?#10  1uF  Voltage - Rated: 25V  Package / Case: 0603  [CAPC0603(1608)_N]
C?#11  1uF  Voltage - Rated: 25V  Package / Case: 0603  [CAPC0603(1608)_N]
C?#12  Capacitance: 0.1µF  Package / Case: 0603  Voltage - Rated: 16V  [CAPC0603(1608)_L]  (hidden comment: 0.1uF)
C?#13  1uF  Voltage - Rated: 25V  Package / Case: 0603  [CAPC0603(1608)_N]
CN?#4  SOIL SENS  [Molex 1x3 Microfit 90deg]
CN?#5  SOIL SENS  [Molex 1x3 Microfit 90deg]
CN?#6  DHT22  [Molex 1x3 Microfit 90deg]
CN?#7  SONAR  [Molex 2x2 Microfit 90deg]
CN?#8  J/Wemo_ESP_Shield  Name: Wemo Mini Shield  [Wemos_d1]
J?  OLED 0.96"  [OLED_0.96_I2C-Header Only]
R?#15  Package / Case: 0603  [RESC0603(1608)_N]  (hidden comment: 4.7K)
R?#16  Resistance (Ohms): 10k  Package / Case: 0603  [RESC0603(1608)_N]  (hidden comment: 10K 1%)
R?#17  Resistance (Ohms): 10k  Package / Case: 0603  [RESC0603(1608)_L]  (hidden comment: 10K 1%)
R?#18  Resistance (Ohms): 10k  Package / Case: 0603  [RESC0603(1608)_L]  (hidden comment: 10K 1%)
SW?#4  SPST-NO 12V  [SW TACT Red 6mm x 6mm]
TP?#10  SCL  [Pogo-Testpoint]  (no BOM)
TP?#11  SDA  [Pogo-Testpoint]  (no BOM)

### Nets
3.3V: C?#8.1 C?#9.1 C?#10.1 C?#11.1 C?#12.1 CN?#4.2 CN?#5.2 CN?#6.2 CN?#7.1 CN?#8.8(3V3) J?.2(VCC) R?#15.2 R?#16.2 R?#17.2 R?#18.2
GND: C?#8.2 C?#9.2 C?#10.2 C?#11.2 C?#12.2 C?#13.2 CN?#4.3 CN?#5.3 CN?#6.3 CN?#7.4 CN?#8.10(GND) J?.1(GND) SW?#4.3 SW?#4.4
BTN_SEL: CN?#8.5(D6)
BTN_SEL2: C?#13.1 R?#16.1 SW?#4.1 SW?#4.2
DHT22: CN?#6.1 CN?#8.11(D4) R?#15.1
ECHO: CN?#7.3 CN?#8.7(D8)
NeoPixel: CN?#8.4(D5)
OLED_SCL: CN?#8.14(D1) J?.3(SCL) R?#17.1 TP?#10.1
OLED_SDA: CN?#8.13(D2) J?.4(SDA) R?#18.1 TP?#11.1
PUMP_CTRL: CN?#8.3(D0)
SOIL_SEN: CN?#8.2(A0)
SOIL_SEN0: CN?#4.1
SOIL_SEN1: CN?#5.1
TRIG: CN?#7.2 CN?#8.6(D7)

Not connected (* = marked no-connect by the designer): CN?#8 1(RST)* 9(5V)* 12(D3)* 15(RX)* 16(TX)*

### Notes on the sheet
- (near CN?#7) 5V level shifter
- OLED Screen
- pg1
- (near CN?#8) OLED_BTN

### Library data of the parts
C?#8-C?#11 C?#13 = CAP CER 1UF 25V 10% X7R 0603: as C15 on sheet ESP_Grow_Main_Rev_B_2_Con; Supplier 1: Digi-Key; RoHS: RoHS Compliant; Category: Capacitors; Stock 1: 360610; Pricing 1: 1=0.2, 10=0.135, 100=0.0686, 500=0.04696, 1000=0.04154 (USD); Packaging: Cut Tape (CT); Part Status: Active; Operating Temperature: -55°C ~ 125°C; Features: -; Ratings: AEC-Q200; Applications: Automotive; Failure Rate: -; Mounting Type: Surface Mount, MLCC; Size / Dimension: 0.063" L x 0.032" W (1.60mm x 0.80mm); Height - Seated (Max): -; Thickness (Max): 0.035" (0.90mm); Lead Spacing: -; Lead Style: -; ComponentLink1URL: https://product.tdk.com/info/en/catalog/datasheets/mlcc_automotive_general_en.pdf; ComponentLink1Description: https://product.tdk.com/info/en/catalog/datasheets/mlcc_automotive_general_en.pdf; Supplier Part Number 1: 445-6931-1-ND
C?#12 = CAP CER 0.1UF 16V 10% X7R 0603: as C?#1 on sheet ESP_Grow_Main_Rev_B_1_CPU; Supplier 1: Digi-Key; RoHS: RoHS Compliant; Category: Capacitors; Stock 1: 2360000; Pricing 1: 4000=0.00414, 8000=0.00378, 12000=0.0036, 28000=0.00342, 100000=0.00248 (USD); Packaging: Tape & Reel (TR); Mounting Type: Surface Mount, MLCC; Operating Temperature: -55°C ~ 125°C; Applications: General Purpose; Ratings: -; Size / Dimension: 0.063" L x 0.031" W (1.60mm x 0.80mm); Height - Seated (Max): -; Thickness (Max): 0.034" (0.87mm); Lead Spacing: -; Features: -; Lead Style: -; ComponentLink1URL: http://www.kemet.com/datasheets&C0603C104K4RACTU; ComponentLink1Description: http://www.kemet.com/datasheets&C0603C104K4RACTU; Supplier Part Number 1: 399-1096-2-ND
CN?#4-CN?#6 = MICROFIT 3.0 HDR 90deg 3CKT: Molex Microfit 1x3 90deg Header; Manufacturer: Molex Inc; Manufacturer Part Number: 0436500304; Connector Type: Header, Shrouded; Number of Positions: 3; Number of Positions Loaded: All; Pitch: 0.118" (3.00mm); ClassName: *; Supplier 1: Digi-Key; RoHS: RoHS Compliant; Category: Connectors, Interconnects; Stock 1: 42564; Pricing 1: 1=1.39, 10=1.224, 50=1.104, 100=1.056, 250=0.96, 500=0.864, 1000=0.768, 2500=0.696, 5000=0.672 (USD); Packaging: Tray; Contact Type: Male Pin; Number of Rows: 1; Row Spacing: -; Contact Mating Length: -; Mounting Type: Through Hole, Right Angle; Termination: Solder; Fastening Type: Locking Ramp; Features: Board Lock; Contact Finish: Gold; Contact Finish Thickness: 15µin (0.38µm); Color: Black; ComponentLink1URL: http://www.molex.com/pdm_docs/sd/436500304_sd.pdf; ComponentLink1Description: http://www.molex.com/pdm_docs/sd/436500304_sd.pdf; Supplier Part Number 1: WM1876-ND
CN?#7 = MICROFIT 3.0 HDR 90deg 4CKT: Molex Microfit 2x2 90deg Header; Manufacturer: Molex Inc; Manufacturer Part Number: 0430450400; Connector Type: Header, Shrouded; Number of Positions: 4; Number of Positions Loaded: All; Pitch: 0.118" (3.00mm); ClassName: *; Supplier 1: Digi-Key; RoHS: RoHS Compliant; Category: Connectors, Interconnects; Stock 1: 9668; Pricing 1: 1=1.35, 10=1.228, 50=1.1026, 100=1.0525, 250=0.95228, 500=0.8771, 1000=0.7518, 2500=0.70168, 5000=0.6666 (USD); Packaging: Tray; Contact Type: Male Pin; Number of Rows: 2; Row Spacing: 0.118" (3.00mm); Contact Mating Length: -; Mounting Type: Through Hole, Right Angle; Termination: Solder; Fastening Type: Locking Ramp; Features: Board Lock; Contact Finish: Tin; Contact Finish Thickness: 100µin (2.54µm); Color: Black; ComponentLink1URL: http://www.molex.com/pdm_docs/sd/430450400_sd.pdf; ComponentLink1Description: http://www.molex.com/pdm_docs/sd/430450400_sd.pdf; Supplier Part Number 1: WM1814-ND
CN?#8 = J/Wemo_ESP_Shield: Wemo Mini Shield for ESP-12
J? = OLED_0.96_I2C: SSD1306 I2C OLED 0.96"
R?#15 = RES 4.7K OHM 1/10W 5% 0603 SMD: 4.7K 0603; Manufacturer: Panasonic Electronic Components; Manufacturer Part Number: ERJ-3GEYJ472V; Tolerance: ±5%; Power (Watts): 0.1W, 1/10W; Temperature Coefficient: ±200ppm/°C; Supplier 1: Digi-Key; RoHS: RoHS Compliant; Category: Resistors; Stock 1: 1261582; Pricing 1: 1=0.1, 50=0.0126, 100=0.0096, 250=0.00716, 500=0.00528, 1000=0.00352, 2500=0.00297 (USD); Packaging: Cut Tape (CT); Resistance (Ohms): 4.7k; Composition: Thick Film; Features: Automotive AEC-Q200 Qualified; Supplier Device Package: 0603; Size / Dimension: 0.063" L x 0.031" W (1.60mm x 0.80mm); Height: 0.022" (0.55mm); Number of Terminations: 2; ComponentLink1URL: http://industrial.panasonic.com/www-cgi/jvcr13pz.cgi?E+PZ+3+AOA0001+ERJ3GEYJ472V+7+WW; ComponentLink1Description: http://industrial.panasonic.com/www-cgi/jvcr13pz.cgi?E+PZ+3+AOA0001+ERJ3GEYJ472V+7+WW; Supplier Part Number 1: P4.7KGCT-ND
R?#16-R?#18 = RES 10K OHM 1/10W 1% 0603 SMD: as R?#7 on sheet ESP_Grow_Main_Rev_B_1_CPU; Category: Resistors; Supplier 1: Digi-Key; RoHS: RoHS Compliant; Stock 1: 5046430; Pricing 1: 1=0.1, 50=0.015, 100=0.0114, 250=0.00844, 500=0.00624, 1000=0.00416, 2500=0.00351 (USD); Packaging: Cut Tape (CT); Tolerance: ±1%; Composition: Thick Film; Features: -; Supplier Device Package: 0603; Size / Dimension: 0.063" L x 0.031" W (1.60mm x 0.80mm); Height: 0.022" (0.55mm); Number of Terminations: 2; ComponentLink1URL: http://industrial.panasonic.com/www-cgi/jvcr13pz.cgi?E+PZ+3+AOA0002+ERJ3EKF1002V+7+WW; ComponentLink1Description: http://industrial.panasonic.com/www-cgi/jvcr13pz.cgi?E+PZ+3+AOA0002+ERJ3EKF1002V+7+WW; Supplier Part Number 1: P10.0KHCT-ND
SW?#4 = PTS645SM43SMTR92 LFS: as SW1 on sheet ESP_Grow_Main_Rev_B_2_Con; ClassName: *; Supplier 1: Digi-Key; Manufacturer Part Number: PTS645SM43SMTR92 LFS; RoHS: RoHS Compliant; Category: Switches; Stock 1: 234699; Pricing 1: 1=0.15, 10=0.147, 25=0.1416, 50=0.1366, 100=0.129, 250=0.12144, 500=0.11638 (USD); Packaging: Cut Tape (CT); Part Status: Active; Circuit: SPST-NO; Mounting Type: Surface Mount; Actuator Length, Right Angle: -; Termination Style: Gull Wing; Illumination Type, Color: -; Illumination Voltage (Nominal): -; Ingress Protection: -; Features: Blue Actuator; Switch Travel: -; Operating Temperature: -20°C ~ 60°C; ComponentLink1URL: http://www.ckswitches.com/media/1471/pts645.pdf; ComponentLink1Description: http://www.ckswitches.com/media/1471/pts645.pdf; Supplier Part Number 1: CKN9112CT-ND
TP?#10 TP?#11 = CMP-001-0557-03: Test Point- Current one; Pin Count: 1; Component Name: TestPoint; Designator: TestPoint